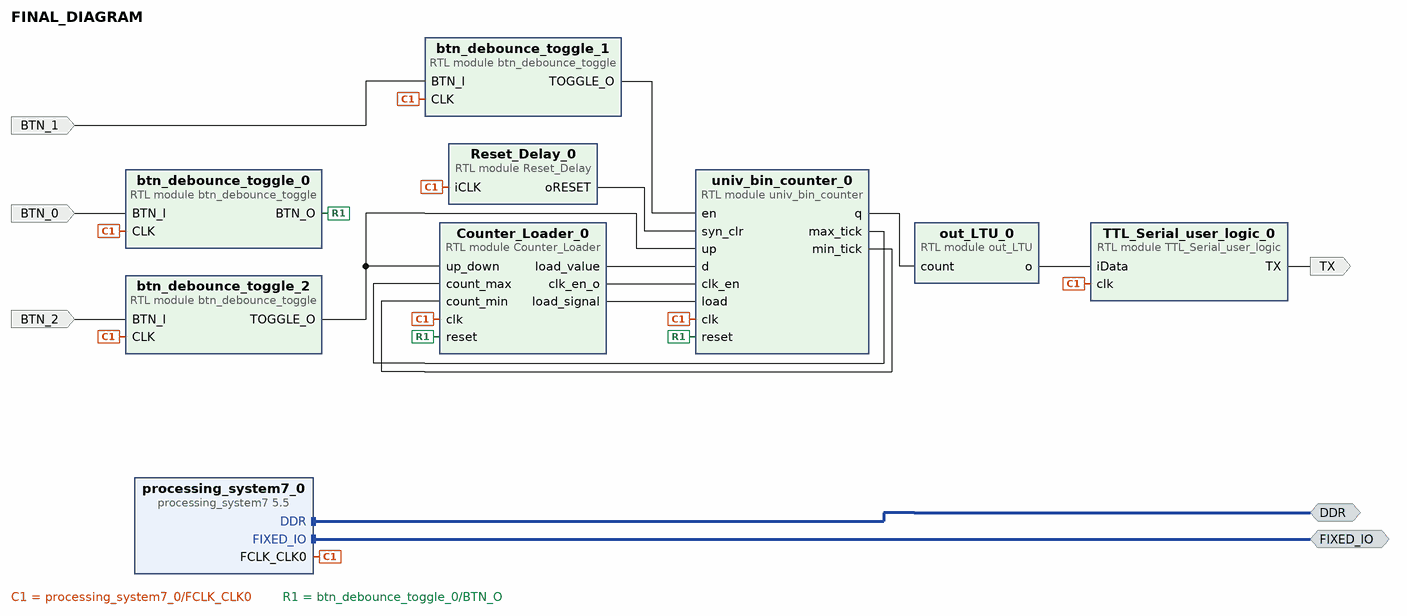
[diagram p0: block diagram of the top level]
# Vivado block design FINAL_DIAGRAM, xc7z010clg225-1, Vivado 2019.1
create_bd_design FINAL_DIAGRAM

create_bd_intf_port -mode Master -vlnv xilinx.com:interface:ddrx_rtl:1.0 DDR
create_bd_intf_port -mode Master -vlnv xilinx.com:display_processing_system7:fixedio_rtl:1.0 FIXED_IO
create_bd_port -dir I BTN_0
create_bd_port -dir I BTN_1
create_bd_port -dir I BTN_2
create_bd_port -dir O TX

create_bd_cell -type ip -vlnv xilinx.com:ip:processing_system7:5.5 processing_system7_0
set_property -dict [list \
  CONFIG.PCW_UART1_PERIPHERAL_ENABLE 1 \
  CONFIG.PCW_UART1_UART1_IO {MIO 8 .. 9} \
  CONFIG.PCW_UART_PERIPHERAL_FREQMHZ 100 \
  CONFIG.PCW_USE_M_AXI_GP0 0 \
] [get_bd_cells processing_system7_0]
# 39 more settings of processing_system7_0 are not shown: defaults, MIO pin electricals, DDR timing, and values the tool derives
create_bd_cell -type module -reference Counter_Loader Counter_Loader_0
create_bd_cell -type module -reference btn_debounce_toggle btn_debounce_toggle_0
create_bd_cell -type module -reference btn_debounce_toggle btn_debounce_toggle_1
set_property -dict {CONFIG.start_value {"1"}} [get_bd_cells btn_debounce_toggle_1]
create_bd_cell -type module -reference btn_debounce_toggle btn_debounce_toggle_2
set_property -dict {CONFIG.start_value {"1"}} [get_bd_cells btn_debounce_toggle_2]
create_bd_cell -type module -reference out_LTU out_LTU_0
create_bd_cell -type module -reference Reset_Delay Reset_Delay_0
set_property -dict {CONFIG.MAX 60} [get_bd_cells Reset_Delay_0]
create_bd_cell -type module -reference univ_bin_counter univ_bin_counter_0
create_bd_cell -type module -reference TTL_Serial_user_logic TTL_Serial_user_logic_0

# ---- connections ----

connect_bd_intf_net [get_bd_intf_ports DDR] [get_bd_intf_pins processing_system7_0/DDR]
connect_bd_intf_net [get_bd_intf_ports FIXED_IO] [get_bd_intf_pins processing_system7_0/FIXED_IO]
connect_bd_net -net BTN_0_1 [get_bd_ports BTN_0] [get_bd_pins btn_debounce_toggle_0/BTN_I]
connect_bd_net -net BTN_1_1 [get_bd_ports BTN_1] [get_bd_pins btn_debounce_toggle_1/BTN_I]
connect_bd_net -net BTN_2_1 [get_bd_ports BTN_2] [get_bd_pins btn_debounce_toggle_2/BTN_I]
connect_bd_net [get_bd_pins processing_system7_0/FCLK_CLK0] \
  [get_bd_pins btn_debounce_toggle_2/CLK] [get_bd_pins btn_debounce_toggle_1/CLK] [get_bd_pins btn_debounce_toggle_0/CLK] \
  [get_bd_pins Counter_Loader_0/clk] [get_bd_pins Reset_Delay_0/iCLK] [get_bd_pins univ_bin_counter_0/clk] \
  [get_bd_pins TTL_Serial_user_logic_0/clk]
connect_bd_net [get_bd_pins btn_debounce_toggle_2/TOGGLE_O] [get_bd_pins Counter_Loader_0/up_down] [get_bd_pins univ_bin_counter_0/up]
connect_bd_net [get_bd_pins btn_debounce_toggle_1/TOGGLE_O] [get_bd_pins univ_bin_counter_0/en]
connect_bd_net [get_bd_pins btn_debounce_toggle_0/BTN_O] [get_bd_pins Counter_Loader_0/reset] [get_bd_pins univ_bin_counter_0/reset]
connect_bd_net [get_bd_pins out_LTU_0/o] [get_bd_pins TTL_Serial_user_logic_0/iData]
connect_bd_net [get_bd_pins univ_bin_counter_0/q] [get_bd_pins out_LTU_0/count]
connect_bd_net [get_bd_pins univ_bin_counter_0/max_tick] [get_bd_pins Counter_Loader_0/count_max]
connect_bd_net [get_bd_pins univ_bin_counter_0/min_tick] [get_bd_pins Counter_Loader_0/count_min]
connect_bd_net [get_bd_pins Counter_Loader_0/load_value] [get_bd_pins univ_bin_counter_0/d]
connect_bd_net [get_bd_pins Counter_Loader_0/clk_en_o] [get_bd_pins univ_bin_counter_0/clk_en]
connect_bd_net [get_bd_pins Counter_Loader_0/load_signal] [get_bd_pins univ_bin_counter_0/load]
connect_bd_net [get_bd_pins TTL_Serial_user_logic_0/TX] [get_bd_ports TX]
connect_bd_net [get_bd_pins Reset_Delay_0/oRESET] [get_bd_pins univ_bin_counter_0/syn_clr]

validate_bd_design
save_bd_design
